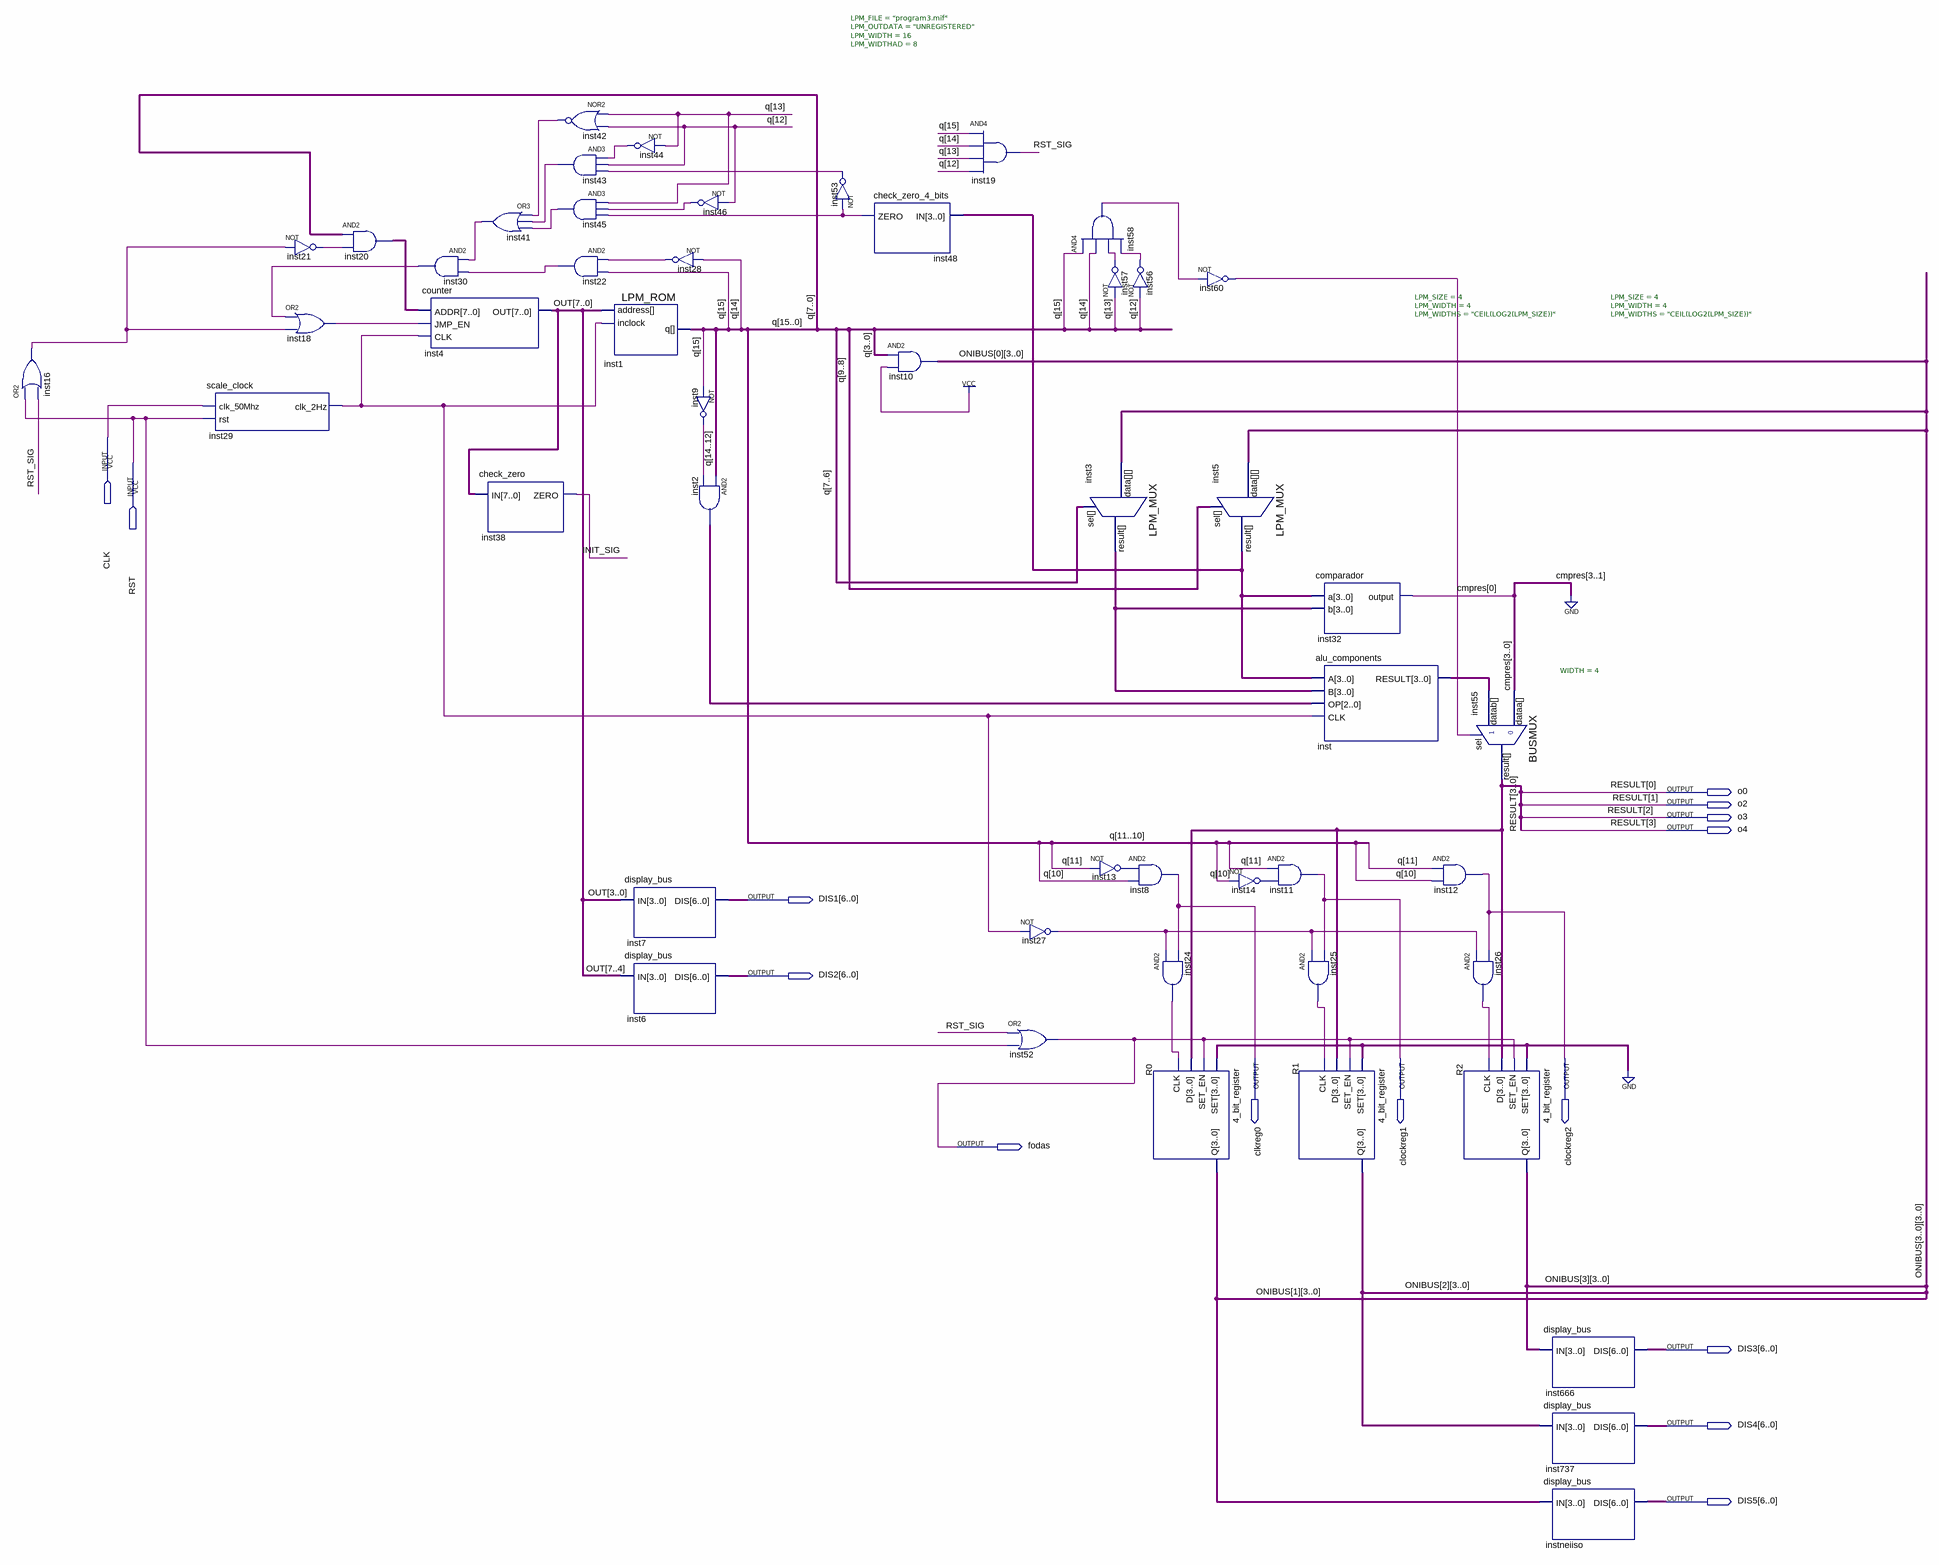
[diagram p0: schematic sheet]
// Quartus schematic CPU_CONTROL_ROM.bdf as structural Verilog: 50 symbols, 15 pins
module CPU_CONTROL_ROM (
  input  CLK,
  input  RST,
  output o0,
  output o2,
  output o3,
  output o4,
  output [6:0] DIS1,
  output [6:0] DIS2,
  output clkreg0,
  output clockreg1,
  output clockreg2,
  output fodas,
  output [6:0] DIS3,
  output [6:0] DIS4,
  output [6:0] DIS5
);

  wire INIT_SIG, inst9_out, inst13_out, inst14_out, inst16_out, inst18_out, inst21_out, inst22_out,
       inst24_out, inst25_out, inst26_out, inst27_out, inst28_out, inst29_clk_2hz, inst30_out, inst41_out,
       inst42_out, inst43_out, inst44_out, inst45_out, inst46_out, inst48_zero, inst53_out, inst56_out,
       inst57_out, inst58_out, inst60_out, RST_SIG;
  wire [0:0] cmpres;
  wire [2:0] inst2_out;
  wire [3:0] inst3_result, inst5_result, inst_result, ONIBUS_0, ONIBUS_1, ONIBUS_2, ONIBUS_3;
  wire [7:0] inst20_out, OUT;
  wire [15:0] q;

  or inst16 (inst16_out, RST, RST_SIG);
  scale_clock inst29 (.clk_50Mhz(CLK), .rst(RST), .clk_2Hz(inst29_clk_2hz));
  not inst21 (inst21_out, inst16_out);
  or inst18 (inst18_out, inst30_out, inst16_out);
  assign inst20_out = q[7:0] & {8{inst21_out}};  // AND2 inst20, 8 bits wide
  and inst30 (inst30_out, inst41_out, inst22_out);
  counter inst4 (.ADDR(inst20_out), .JMP_EN(inst18_out), .CLK(inst29_clk_2hz), .OUT(OUT));
  or inst41 (inst41_out, inst42_out, inst43_out, inst45_out);
  check_zero inst38 (.IN(OUT), .ZERO(INIT_SIG));
  nor inst42 (inst42_out, q[13], q[12]);
  and inst43 (inst43_out, inst44_out, q[12], inst53_out);
  and inst45 (inst45_out, q[13], inst46_out, inst48_zero);
  and inst22 (inst22_out, inst28_out, q[15]);
  LPM_ROM #(.LPM_FILE("program3.mif"), .LPM_OUTDATA("UNREGISTERED"), .LPM_WIDTH(16), .LPM_WIDTHAD(8)) inst1 (
    .address(OUT), .inclock(inst29_clk_2hz), .q(q));
  not inst44 (inst44_out, q[13]);
  display_bus inst7 (.IN(OUT[3:0]), .DIS(DIS1));
  display_bus inst6 (.IN(OUT[7:4]), .DIS(DIS2));
  not inst46 (inst46_out, q[12]);
  not inst28 (inst28_out, q[14]);
  not inst9 (inst9_out, q[15]);
  assign inst2_out = q[14:12] & {3{inst9_out}};  // AND2 inst2, 3 bits wide
  not inst53 (inst53_out, inst48_zero);
  check_zero_4_bits inst48 (.IN(inst5_result), .ZERO(inst48_zero));
  assign ONIBUS_0 = q[3:0] & 4'b1111;  // AND2 inst10, 4 bits wide
  and inst19 (RST_SIG, q[15], q[14], q[13], q[12]);
  or inst52 (fodas, RST_SIG, RST);
  not inst27 (inst27_out, inst29_clk_2hz);
  and inst58 (inst58_out, q[15], q[14], inst57_out, inst56_out);
  not inst57 (inst57_out, q[13]);
  LPM_MUX #(.LPM_SIZE(4), .LPM_WIDTH(4), .LPM_WIDTHS("CEIL(LOG2(LPM_SIZE))")) inst3 (
    .data({ONIBUS_3, ONIBUS_2, ONIBUS_1, ONIBUS_0}), .sel(q[7:6]), .result(inst3_result));
  not inst13 (inst13_out, q[11]);
  not inst56 (inst56_out, q[12]);
  and inst8 (clkreg0, inst13_out, q[10]);
  and inst24 (inst24_out, inst27_out, clkreg0);
  \4_bit_register  R0 (.SET(4'b0000), .SET_EN(fodas), .D({o4, o3, o2, o0}), .CLK(inst24_out), .Q(ONIBUS_1));
  not inst60 (inst60_out, inst58_out);
  LPM_MUX #(.LPM_SIZE(4), .LPM_WIDTH(4), .LPM_WIDTHS("CEIL(LOG2(LPM_SIZE))")) inst5 (
    .data({ONIBUS_3, ONIBUS_2, ONIBUS_1, ONIBUS_0}), .sel(q[9:8]), .result(inst5_result));
  not inst14 (inst14_out, q[10]);
  comparador inst32 (.a(inst5_result), .b(inst3_result), .\output (cmpres[0]));
  alu_components inst (.A(inst5_result), .B(inst3_result), .OP(inst2_out), .CLK(inst29_clk_2hz), .RESULT(inst_result));
  and inst11 (clockreg1, q[11], inst14_out);
  and inst25 (inst25_out, inst27_out, clockreg1);
  \4_bit_register  R1 (.SET(4'b0000), .SET_EN(fodas), .D({o4, o3, o2, o0}), .CLK(inst25_out), .Q(ONIBUS_2));
  and inst12 (clockreg2, q[11], q[10]);
  and inst26 (inst26_out, inst27_out, clockreg2);
  \4_bit_register  R2 (.SET(4'b0000), .SET_EN(fodas), .D({o4, o3, o2, o0}), .CLK(inst26_out), .Q(ONIBUS_3));
  BUSMUX #(.WIDTH(4)) inst55 (
    .datab(inst_result), .sel(inst60_out), .dataa({3'b000, cmpres[0]}), .result({o4, o3, o2, o0}));
  display_bus inst666 (.IN(ONIBUS_3), .DIS(DIS3));
  display_bus inst737 (.IN(ONIBUS_2), .DIS(DIS4));
  display_bus instneiiso (.IN(ONIBUS_1), .DIS(DIS5));

  // Other names for the same wires on the sheet: RESULT[3:0] = {o4, o3, o2, o0}
endmodule
